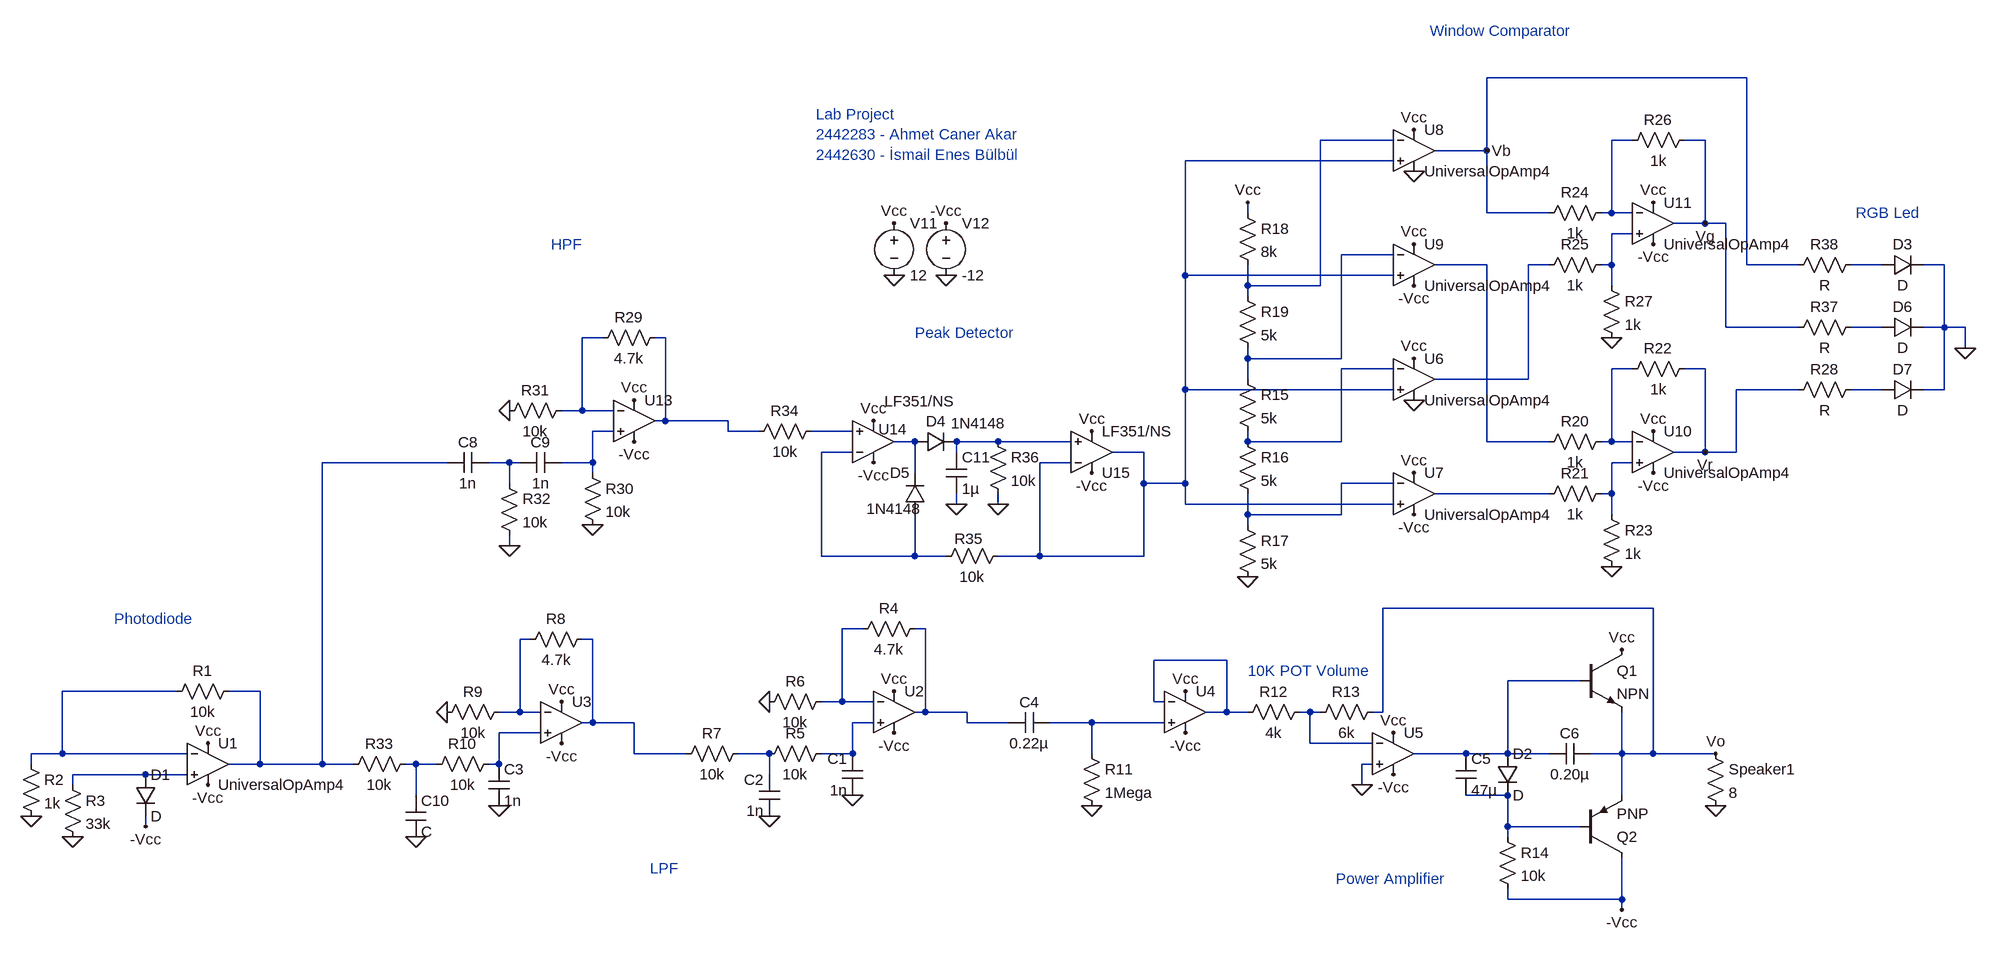
[diagram p0: schematic receiver.asc]
receiver.asc, the LTspice schematic file:
Version 4
SHEET 1 2068 1352
WIRE 1440 -192 1040 -192
WIRE 896 -96 784 -96
WIRE 1264 -96 1232 -96
WIRE 1376 -96 1344 -96
WIRE 1040 -80 1040 -192
WIRE 1040 -80 960 -80
WIRE 896 -64 576 -64
WIRE 672 16 672 0
WIRE 1040 16 1040 -80
WIRE 1136 16 1040 16
WIRE 1232 16 1232 -96
WIRE 1232 16 1216 16
WIRE 1264 16 1232 16
WIRE 1376 32 1376 -96
WIRE 1376 32 1328 32
WIRE 1408 32 1376 32
WIRE 1264 48 1232 48
WIRE 896 80 816 80
WIRE 1040 96 960 96
WIRE 1136 96 1104 96
WIRE 1232 96 1232 48
WIRE 1232 96 1216 96
WIRE 1440 96 1440 -192
WIRE 1520 96 1440 96
WIRE 1648 96 1600 96
WIRE 1744 96 1712 96
WIRE 576 112 576 -64
WIRE 896 112 576 112
WIRE 672 128 672 96
WIRE 784 128 784 -96
WIRE 784 128 672 128
WIRE 1232 128 1232 96
WIRE 672 144 672 128
WIRE 1408 192 1408 32
WIRE 1520 192 1408 192
WIRE 1648 192 1600 192
WIRE 1744 192 1744 96
WIRE 1744 192 1712 192
WIRE 1776 192 1744 192
WIRE -320 208 -352 208
WIRE -224 208 -240 208
WIRE 1776 224 1776 192
WIRE 672 240 672 224
WIRE 816 240 816 80
WIRE 816 240 672 240
WIRE 896 256 816 256
WIRE 1264 256 1232 256
WIRE 1376 256 1344 256
WIRE 672 272 672 240
WIRE 1104 272 1104 96
WIRE 1104 272 960 272
WIRE 576 288 576 112
WIRE 896 288 576 288
WIRE 1520 288 1424 288
WIRE 1648 288 1600 288
WIRE 1744 288 1744 192
WIRE 1744 288 1712 288
WIRE -352 320 -352 208
WIRE -352 320 -384 320
WIRE -304 320 -352 320
WIRE -224 336 -224 208
WIRE -224 336 -240 336
WIRE -128 336 -224 336
WIRE -304 352 -336 352
WIRE -128 352 -128 336
WIRE -80 352 -128 352
WIRE 64 352 0 352
WIRE 160 368 128 368
WIRE 288 368 224 368
WIRE 400 368 288 368
WIRE 672 368 672 352
WIRE 816 368 816 256
WIRE 816 368 672 368
WIRE 1040 368 1040 96
WIRE 1136 368 1040 368
WIRE 1232 368 1232 256
WIRE 1232 368 1216 368
WIRE 1264 368 1232 368
WIRE 64 384 16 384
WIRE 224 384 224 368
WIRE 512 384 464 384
WIRE 1376 384 1376 256
WIRE 1376 384 1328 384
WIRE 1424 384 1424 288
WIRE 1424 384 1376 384
WIRE -560 400 -752 400
WIRE -464 400 -496 400
WIRE -448 400 -464 400
WIRE -336 400 -336 352
WIRE -336 400 -384 400
WIRE 400 400 352 400
WIRE 1264 400 1232 400
WIRE -336 416 -336 400
WIRE 160 416 160 368
WIRE -464 432 -464 400
WIRE 512 432 512 384
WIRE 576 432 576 288
WIRE 576 432 512 432
WIRE 896 432 816 432
WIRE 1136 448 960 448
WIRE 1232 448 1232 400
WIRE 1232 448 1216 448
WIRE 224 464 224 448
WIRE 288 464 288 448
WIRE 576 464 576 432
WIRE 896 464 576 464
WIRE 672 480 672 448
WIRE 816 480 816 432
WIRE 816 480 672 480
WIRE 1232 480 1232 448
WIRE 672 496 672 480
WIRE -464 528 -464 512
WIRE 16 544 16 384
WIRE 160 544 160 480
WIRE 160 544 16 544
WIRE 208 544 160 544
WIRE 352 544 352 400
WIRE 352 544 288 544
WIRE 512 544 512 432
WIRE 512 544 352 544
WIRE 1296 624 880 624
WIRE 80 656 48 656
WIRE 176 656 160 656
WIRE -432 672 -448 672
WIRE -336 672 -352 672
WIRE 640 704 528 704
WIRE 1184 736 1072 736
WIRE -976 752 -1152 752
WIRE -848 752 -896 752
WIRE 48 768 48 656
WIRE 48 768 16 768
WIRE 96 768 48 768
WIRE 528 768 528 704
WIRE 544 768 528 768
WIRE -448 784 -448 672
WIRE -448 784 -480 784
WIRE -416 784 -448 784
WIRE 176 784 176 656
WIRE 176 784 160 784
WIRE 240 784 176 784
WIRE 640 784 640 704
WIRE 640 784 608 784
WIRE 672 784 640 784
WIRE 768 784 752 784
WIRE 784 784 768 784
WIRE 880 784 880 624
WIRE 880 784 864 784
WIRE -336 800 -336 672
WIRE -336 800 -352 800
WIRE -272 800 -336 800
WIRE 96 800 64 800
WIRE 240 800 240 784
WIRE 304 800 240 800
WIRE 432 800 368 800
WIRE 544 800 432 800
WIRE -416 816 -480 816
WIRE 768 832 768 784
WIRE 864 832 768 832
WIRE -1152 848 -1152 752
WIRE -1152 848 -1200 848
WIRE -960 848 -1152 848
WIRE -272 848 -272 800
WIRE -192 848 -272 848
WIRE -64 848 -112 848
WIRE 64 848 64 800
WIRE 64 848 16 848
WIRE 432 848 432 800
WIRE 1008 848 928 848
WIRE 1072 848 1072 736
WIRE 1072 848 1008 848
WIRE 1136 848 1072 848
WIRE 1248 848 1248 784
WIRE 1248 848 1200 848
WIRE 1296 848 1296 624
WIRE 1296 848 1248 848
WIRE 1392 848 1296 848
WIRE -1200 864 -1200 848
WIRE -848 864 -848 752
WIRE -848 864 -896 864
WIRE -752 864 -752 400
WIRE -752 864 -848 864
WIRE -704 864 -752 864
WIRE -608 864 -624 864
WIRE -576 864 -608 864
WIRE -480 864 -480 816
WIRE -480 864 -496 864
WIRE 864 864 848 864
WIRE -1024 880 -1136 880
WIRE -960 880 -1024 880
WIRE -64 880 -64 848
WIRE -1136 896 -1136 880
WIRE 848 896 848 864
WIRE -608 912 -608 864
WIRE 1072 912 1008 912
WIRE 1248 912 1248 848
WIRE -1024 960 -1024 944
WIRE 1072 960 1072 912
WIRE 1184 960 1072 960
WIRE 1072 976 1072 960
WIRE 1072 1072 1072 1056
WIRE 1248 1072 1248 1008
WIRE 1248 1072 1072 1072
WIRE 1248 1088 1248 1072
FLAG -928 832 Vcc
FLAG -928 896 -Vcc
FLAG -1136 976 0
FLAG -1200 944 0
FLAG -1024 960 -Vcc
FLAG 128 752 Vcc
FLAG 128 816 -Vcc
FLAG 64 912 0
FLAG -64 768 0
FLAG -384 768 Vcc
FLAG -384 832 -Vcc
FLAG -560 784 0
FLAG -480 928 0
FLAG 1392 928 0
FLAG 576 752 Vcc
FLAG 896 816 Vcc
FLAG 1248 688 Vcc
FLAG 576 816 -Vcc
FLAG 896 880 -Vcc
FLAG 1248 1088 -Vcc
FLAG 432 928 0
FLAG 1392 848 Vo
FLAG 848 896 0
FLAG 928 240 Vcc
FLAG 928 416 Vcc
FLAG 928 480 -Vcc
FLAG 672 576 0
FLAG 928 -112 Vcc
FLAG 928 64 Vcc
FLAG 928 128 -Vcc
FLAG 672 0 Vcc
FLAG 1040 -80 Vb
FLAG 1296 352 Vcc
FLAG 1296 416 -Vcc
FLAG 1232 560 0
FLAG 1296 0 Vcc
FLAG 1296 64 -Vcc
FLAG 1232 208 0
FLAG 1376 32 Vg
FLAG 1376 384 Vr
FLAG 928 304 0
FLAG 928 -48 0
FLAG 208 112 0
FLAG 128 112 0
FLAG 128 32 Vcc
FLAG 208 32 -Vcc
FLAG -272 304 Vcc
FLAG -272 368 -Vcc
FLAG -336 496 0
FLAG -464 320 0
FLAG -64 944 0
FLAG -464 528 0
FLAG -608 976 0
FLAG 224 464 0
FLAG 288 464 0
FLAG 96 400 -Vcc
FLAG 432 416 -Vcc
FLAG 96 336 Vcc
FLAG 432 352 Vcc
FLAG 1776 224 0
SYMBOL OpAmps\\UniversalOpAmp4 -928 864 R0
SYMATTR InstName U1
SYMBOL res -880 736 R90
WINDOW 0 0 56 VBottom 2
WINDOW 3 32 56 VTop 2
SYMATTR InstName R1
SYMATTR Value 10k
SYMBOL res -1216 848 R0
SYMATTR InstName R2
SYMATTR Value 1k
SYMBOL res -1152 880 R0
SYMATTR InstName R3
SYMATTR Value 33k
SYMBOL diode -1040 880 R0
SYMATTR InstName D1
SYMBOL OpAmps\\UniversalOpAmp 128 784 R0
SYMATTR InstName U2
SYMBOL res 176 640 R90
WINDOW 0 0 56 VBottom 2
WINDOW 3 32 56 VTop 2
SYMATTR InstName R4
SYMATTR Value 4.7k
SYMBOL res -80 864 R270
WINDOW 0 32 56 VTop 2
WINDOW 3 0 56 VBottom 2
SYMATTR InstName R5
SYMATTR Value 10k
SYMBOL cap 80 912 R180
WINDOW 0 24 56 Left 2
WINDOW 3 24 8 Left 2
SYMATTR InstName C1
SYMATTR Value 1n
SYMBOL res 32 752 R90
WINDOW 0 0 56 VBottom 2
WINDOW 3 32 56 VTop 2
SYMATTR InstName R6
SYMATTR Value 10k
SYMBOL res -208 864 R270
WINDOW 0 32 56 VTop 2
WINDOW 3 0 56 VBottom 2
SYMATTR InstName R7
SYMATTR Value 10k
SYMBOL cap -48 944 R180
WINDOW 0 24 56 Left 2
WINDOW 3 24 8 Left 2
SYMATTR InstName C2
SYMATTR Value 1n
SYMBOL OpAmps\\UniversalOpAmp -384 800 R0
SYMATTR InstName U3
SYMBOL res -336 656 R90
WINDOW 0 0 56 VBottom 2
WINDOW 3 32 56 VTop 2
SYMATTR InstName R8
SYMATTR Value 4.7k
SYMBOL res -464 768 R90
WINDOW 0 0 56 VBottom 2
WINDOW 3 32 56 VTop 2
SYMATTR InstName R9
SYMATTR Value 10k
SYMBOL res -480 848 R90
WINDOW 0 0 56 VBottom 2
WINDOW 3 32 56 VTop 2
SYMATTR InstName R10
SYMATTR Value 10k
SYMBOL cap -496 864 R0
SYMATTR InstName C3
SYMATTR Value 1n
SYMBOL cap 368 784 R90
WINDOW 0 0 32 VBottom 2
WINDOW 3 32 32 VTop 2
SYMATTR InstName C4
SYMATTR Value 0.22µ
SYMBOL res 416 832 R0
SYMATTR InstName R11
SYMATTR Value 1Mega
SYMBOL OpAmps\\UniversalOpAmp2 576 784 R0
SYMATTR InstName U4
SYMBOL res 768 768 R90
WINDOW 0 0 56 VBottom 2
WINDOW 3 32 56 VTop 2
SYMATTR InstName R12
SYMATTR Value 4k
SYMBOL OpAmps\\UniversalOpAmp2 896 848 R0
SYMATTR InstName U5
SYMBOL res 880 768 R90
WINDOW 0 0 56 VBottom 2
WINDOW 3 32 56 VTop 2
SYMATTR InstName R13
SYMATTR Value 6k
SYMBOL cap 992 848 R0
SYMATTR InstName C5
SYMATTR Value 47µ
SYMBOL diode 1056 848 R0
SYMATTR InstName D2
SYMBOL cap 1200 832 R90
WINDOW 0 0 32 VBottom 2
WINDOW 3 32 32 VTop 2
SYMATTR InstName C6
SYMATTR Value 0.20µ
SYMBOL npn 1184 688 R0
SYMATTR InstName Q1
SYMBOL pnp 1184 1008 M180
SYMATTR InstName Q2
SYMBOL res 1056 960 R0
SYMATTR InstName R14
SYMATTR Value 10k
SYMBOL res 1376 832 R0
SYMATTR InstName Speaker1
SYMATTR Value 8
SYMBOL OpAmps\\UniversalOpAmp4 928 272 R0
SYMATTR InstName U6
SYMBOL OpAmps\\UniversalOpAmp4 928 448 R0
SYMATTR InstName U7
SYMBOL res 656 256 R0
SYMATTR InstName R15
SYMATTR Value 5k
SYMBOL res 656 352 R0
SYMATTR InstName R16
SYMATTR Value 5k
SYMBOL res 656 480 R0
SYMATTR InstName R17
SYMATTR Value 5k
SYMBOL OpAmps\\UniversalOpAmp4 928 -80 R0
SYMATTR InstName U8
SYMBOL OpAmps\\UniversalOpAmp4 928 96 R0
SYMATTR InstName U9
SYMBOL res 656 0 R0
SYMATTR InstName R18
SYMATTR Value 8k
SYMBOL res 656 128 R0
SYMATTR InstName R19
SYMATTR Value 5k
SYMBOL OpAmps\\UniversalOpAmp4 1296 384 R0
SYMATTR InstName U10
SYMBOL res 1232 352 R90
WINDOW 0 0 56 VBottom 2
WINDOW 3 32 56 VTop 2
SYMATTR InstName R20
SYMATTR Value 1k
SYMBOL res 1232 432 R90
WINDOW 0 0 56 VBottom 2
WINDOW 3 32 56 VTop 2
SYMATTR InstName R21
SYMATTR Value 1k
SYMBOL res 1360 240 R90
WINDOW 0 0 56 VBottom 2
WINDOW 3 32 56 VTop 2
SYMATTR InstName R22
SYMATTR Value 1k
SYMBOL res 1216 464 R0
SYMATTR InstName R23
SYMATTR Value 1k
SYMBOL OpAmps\\UniversalOpAmp4 1296 32 R0
SYMATTR InstName U11
SYMBOL res 1232 0 R90
WINDOW 0 0 56 VBottom 2
WINDOW 3 32 56 VTop 2
SYMATTR InstName R24
SYMATTR Value 1k
SYMBOL res 1232 80 R90
WINDOW 0 0 56 VBottom 2
WINDOW 3 32 56 VTop 2
SYMATTR InstName R25
SYMATTR Value 1k
SYMBOL res 1360 -112 R90
WINDOW 0 0 56 VBottom 2
WINDOW 3 32 56 VTop 2
SYMATTR InstName R26
SYMATTR Value 1k
SYMBOL res 1216 112 R0
SYMATTR InstName R27
SYMATTR Value 1k
SYMBOL OpAmps\\UniversalOpAmp -272 336 R0
SYMATTR InstName U13
SYMBOL voltage 128 16 R0
WINDOW 123 0 0 Left 0
WINDOW 39 0 0 Left 0
SYMATTR InstName V11
SYMATTR Value 12
SYMBOL voltage 208 16 R0
WINDOW 123 0 0 Left 0
WINDOW 39 0 0 Left 0
SYMATTR InstName V12
SYMATTR Value -12
SYMBOL res -224 192 R90
WINDOW 0 0 56 VBottom 2
WINDOW 3 32 56 VTop 2
SYMATTR InstName R29
SYMATTR Value 4.7k
SYMBOL res -352 400 R0
SYMATTR InstName R30
SYMATTR Value 10k
SYMBOL cap -560 416 R270
WINDOW 0 32 32 VTop 2
WINDOW 3 0 32 VBottom 2
SYMATTR InstName C8
SYMATTR Value 1n
SYMBOL res -368 304 R90
WINDOW 0 0 56 VBottom 2
WINDOW 3 32 56 VTop 2
SYMATTR InstName R31
SYMATTR Value 10k
SYMBOL res -480 416 R0
SYMATTR InstName R32
SYMATTR Value 10k
SYMBOL cap -448 416 R270
WINDOW 0 32 32 VTop 2
WINDOW 3 0 32 VBottom 2
SYMATTR InstName C9
SYMATTR Value 1n
SYMBOL res -608 848 R90
WINDOW 0 0 56 VBottom 2
WINDOW 3 32 56 VTop 2
SYMATTR InstName R33
SYMATTR Value 10k
SYMBOL cap -624 912 R0
SYMATTR InstName C10
SYMBOL diode 160 384 R270
WINDOW 0 32 32 VTop 2
WINDOW 3 60 98 VBottom 2
SYMATTR InstName D4
SYMATTR Value 1N4148
SYMBOL cap 208 384 R0
SYMATTR InstName C11
SYMATTR Value 1µ
SYMBOL uA741 96 432 M180
WINDOW 0 8 83 Left 2
WINDOW 3 17 126 Left 2
SYMATTR InstName U14
SYMATTR Value LF351/NS
SYMBOL uA741 432 448 M180
SYMATTR InstName U15
SYMATTR Value LF351/NS
SYMBOL res 16 336 R90
WINDOW 0 0 56 VBottom 2
WINDOW 3 32 56 VTop 2
SYMATTR InstName R34
SYMATTR Value 10k
SYMBOL diode 176 480 R180
WINDOW 0 24 64 Left 2
WINDOW 3 6 9 Left 2
SYMATTR InstName D5
SYMATTR Value 1N4148
SYMBOL res 304 528 R90
WINDOW 0 5 61 VBottom 2
WINDOW 3 32 56 VTop 2
SYMATTR InstName R35
SYMATTR Value 10k
SYMBOL res 272 352 R0
SYMATTR InstName R36
SYMATTR Value 10k
SYMBOL res 1616 272 R90
WINDOW 0 0 56 VBottom 2
WINDOW 3 32 56 VTop 2
SYMATTR InstName R28
SYMBOL res 1616 176 R90
WINDOW 0 0 56 VBottom 2
WINDOW 3 32 56 VTop 2
SYMATTR InstName R37
SYMBOL res 1616 80 R90
WINDOW 0 0 56 VBottom 2
WINDOW 3 32 56 VTop 2
SYMATTR InstName R38
SYMBOL diode 1648 112 R270
WINDOW 0 32 32 VTop 2
WINDOW 3 0 32 VBottom 2
SYMATTR InstName D3
SYMBOL diode 1648 208 R270
WINDOW 0 32 32 VTop 2
WINDOW 3 0 32 VBottom 2
SYMATTR InstName D6
SYMBOL diode 1648 304 R270
WINDOW 0 32 32 VTop 2
WINDOW 3 0 32 VBottom 2
SYMATTR InstName D7
TEXT 8 -136 Left 2 ;Lab Project\n2442283 - Ahmet Caner Akar\n2442630 - İsmail Enes Bülbül
TEXT 672 720 Left 2 ;10K POT Volume
TEXT -1072 640 Left 2 ;Photodiode
TEXT -248 1024 Left 2 ;LPF
TEXT -400 64 Left 2 ;HPF
TEXT 160 200 Left 2 ;Peak Detector
TEXT 952 -264 Left 2 ;Window Comparator
TEXT 1608 16 Left 2 ;RGB Led
TEXT 808 1040 Left 2 ;Power Amplifier

The netlist it stands for:
* receiver.asc
* U1: UniversalOpAmp4 (symbol OpAmps\UniversalOpAmp4 not available, pins judged from their places): In+=N038 In-=N031 V+=Vcc V-=-Vcc OUT=N020
R1 N020 N031 10k
R2 N031 0 1k
R3 N038 0 33k
D1 N038 -Vcc D
XU2 N033 N025 Vcc -Vcc N026 level1 Avol=1Meg GBW=10Meg Vos=0 En=0 Enk=0 In=0 Ink=0 Rin=500Meg  ; pins In+ In- V+ V- OUT
R4 N026 N025 4.7k
R5 N036 N033 10k
C1 0 N033 1n
R6 N025 0 10k
R7 N028 N036 10k
C2 0 N036 1n
XU3 N035 N027 Vcc -Vcc N028 level1 Avol=1Meg GBW=10Meg Vos=0 En=0 Enk=0 In=0 Ink=0 Rin=500Meg  ; pins In+ In- V+ V- OUT
R8 N028 N027 4.7k
R9 N027 0 10k
R10 N035 N037 10k
C3 N035 0 1n
C4 N034 N026 0.22µ
R11 N034 0 1Mega
XU4 N034 N029 Vcc -Vcc N029 level2 Avol=1Meg GBW=10Meg Slew=10Meg Ilimit=25m Rail=0 Vos=0 En=0 Enk=0 In=0 Ink=0 Rin=500Meg  ; pins In+ In- V+ V- OUT
R12 N032 N029 4k
XU5 0 N032 Vcc -Vcc N030 level2 Avol=1Meg GBW=10Meg Slew=10Meg Ilimit=25m Rail=0 Vos=0 En=0 Enk=0 In=0 Ink=0 Rin=500Meg  ; pins In+ In- V+ V- OUT
R13 Vo N032 6k
C5 N030 N039 47µ
D2 N030 N039 D
C6 Vo N030 0.20µ
Q1 Vcc N030 Vo 0 NPN
Q2 -Vcc N039 Vo 0 PNP
R14 N039 -Vcc 10k
R§Speaker1 Vo 0 8
* U6: UniversalOpAmp4 (symbol OpAmps\UniversalOpAmp4 not available, pins judged from their places): In+=N003 In-=N012 V+=Vcc V-=0 OUT=N007
* U7: UniversalOpAmp4 (symbol OpAmps\UniversalOpAmp4 not available, pins judged from their places): In+=N003 In-=N023 V+=Vcc V-=-Vcc OUT=N024
R15 N005 N012 5k
R16 N012 N023 5k
R17 N023 0 5k
* U8: UniversalOpAmp4 (symbol OpAmps\UniversalOpAmp4 not available, pins judged from their places): In+=N003 In-=N001 V+=Vcc V-=0 OUT=Vb
* U9: UniversalOpAmp4 (symbol OpAmps\UniversalOpAmp4 not available, pins judged from their places): In+=N003 In-=N005 V+=Vcc V-=-Vcc OUT=N006
R18 Vcc N001 8k
R19 N001 N005 5k
* U10: UniversalOpAmp4 (symbol OpAmps\UniversalOpAmp4 not available, pins judged from their places): In+=N022 In-=N013 V+=Vcc V-=-Vcc OUT=Vr
R20 N013 N006 1k
R21 N022 N024 1k
R22 Vr N013 1k
R23 N022 0 1k
* U11: UniversalOpAmp4 (symbol OpAmps\UniversalOpAmp4 not available, pins judged from their places): In+=N004 In-=N002 V+=Vcc V-=-Vcc OUT=Vg
R24 N002 Vb 1k
R25 N004 N007 1k
R26 Vg N002 1k
R27 N004 0 1k
XU13 N015 N010 Vcc -Vcc N011 level1 Avol=1Meg GBW=10Meg Vos=0 En=0 Enk=0 In=0 Ink=0 Rin=500Meg  ; pins In+ In- V+ V- OUT
V11 Vcc 0 12
V12 -Vcc 0 -12
R29 N011 N010 4.7k
R30 N015 0 10k
C8 N020 N021 1n
R31 N010 0 10k
R32 N021 0 10k
C9 N021 N015 1n
R33 N037 N020 10k
C10 N037 0 C
D4 N017 N018 1N4148
C11 N018 0 1µ
* U14: LF351/NS (symbol uA741 not available, pins judged from their places): In+=N016 In-=N019 V+=-Vcc V-=Vcc OUT=N017
* U15: LF351/NS (symbol uA741 not available, pins judged from their places): In+=N018 In-=N003 V+=-Vcc V-=Vcc OUT=N003
R34 N016 N011 10k
D5 N019 N017 1N4148
R35 N003 N019 10k
R36 N018 0 10k
R28 N014 Vr R
R37 N009 Vg R
R38 N008 Vb R
D3 N008 0 D
D6 N009 0 D
D7 N014 0 D
.model D D
.lib standard.dio
.model NPN NPN
.model PNP PNP
.lib standard.bjt
* Lab Project
* 2442283 - Ahmet Caner Akar
* 2442630 - İsmail Enes Bülbül
* 10K POT Volume
* Photodiode
* LPF
* HPF
* Peak Detector
* Window Comparator
* RGB Led
* Power Amplifier
.lib UniversalOpAmp1.lib
.lib UniversalOpAmp2.lib
.backanno
.end